# EAGLE schematic Nusbio Test GPIOS Extension (EAGLE 9.6.2)
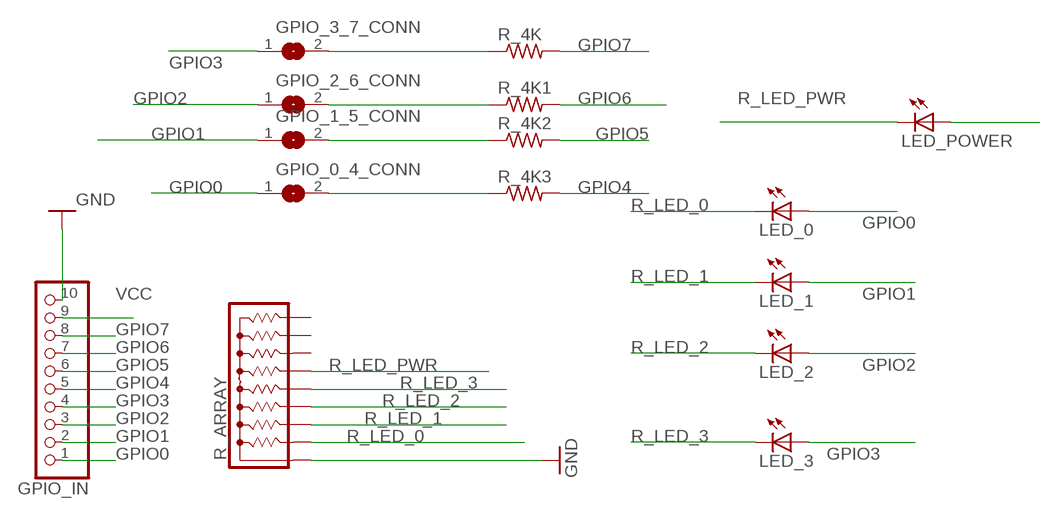
[diagram p0: schematic, sheet 1]

## Parts
GPIO_0_4_CONN  SOLDERJUMPERREFLOW  [SOLDERJUMPER_REFLOW]
GPIO_1_5_CONN  SOLDERJUMPERREFLOW  [SOLDERJUMPER_REFLOW]
GPIO_2_6_CONN  SOLDERJUMPERREFLOW  [SOLDERJUMPER_REFLOW]
GPIO_3_7_CONN  SOLDERJUMPERREFLOW  [SOLDERJUMPER_REFLOW]
GPIO_IN  PINHD-1X10  [1X10-BIG]
LED_0  LEDSMT1206  [1206]
LED_1  LEDSMT1206  [1206]
LED_2  LEDSMT1206  [1206]
LED_3  LEDSMT1206  [1206]
LED_POWER  LEDSMT1206  [1206]
R_4K  R-US_R1206  [R1206]
R_4K1  R-US_R1206  [R1206]
R_4K2  R-US_R1206  [R1206]
R_4K3  R-US_R1206  [R1206]
R_ARRAY  4609X  [SIP9]

## Nets
GND: GPIO_IN.10 R_ARRAY.1
GPIO0: GPIO_0_4_CONN.1 GPIO_IN.1 LED_0.A
GPIO1: GPIO_1_5_CONN.1 GPIO_IN.2 LED_1.A
GPIO2: GPIO_2_6_CONN.1 GPIO_IN.3 LED_2.A
GPIO3: GPIO_3_7_CONN.1 GPIO_IN.4 LED_3.A
GPIO4: GPIO_IN.5 R_4K3.2
GPIO5: GPIO_IN.6 R_4K2.2
GPIO6: GPIO_IN.7 R_4K1.2
GPIO7: GPIO_IN.8 R_4K.2
N$1: GPIO_3_7_CONN.2 R_4K.1
N$2: GPIO_2_6_CONN.2 R_4K1.1
N$3: GPIO_1_5_CONN.2 R_4K2.1
N$4: GPIO_0_4_CONN.2 R_4K3.1
R_LED_0: LED_0.C R_ARRAY.2
R_LED_1: LED_1.C R_ARRAY.3
R_LED_2: LED_2.C R_ARRAY.4
R_LED_3: LED_3.C R_ARRAY.5
R_LED_PWR: LED_POWER.C R_ARRAY.6
VCC: GPIO_IN.9 LED_POWER.A
Unconnected: R_ARRAY.7 R_ARRAY.8 R_ARRAY.9

## Library data of the parts
GPIO_0_4_CONN GPIO_1_5_CONN GPIO_2_6_CONN GPIO_3_7_CONN = microbuilder:SOLDERJUMPER: SMD Solder JUMPER Solder the two pads together to create a connection, or remove the solder to break it. REFLOW - Use this footprint for solder paste and reflow ovens. WAVE - Use this footprint for hand-soldering (larger pads). CLOSED - Has a trace between the two pads to ensure it is closed by default. The trace needs to be cut to disable the jumper, and can be closed again by creating a solder bridge between the two pads.
GPIO_IN = adafruit:PINHD-1X10: Pin header 1x10 0.1" spacing With round pins
LED_0 LED_1-LED_3 LED_POWER = adafruit:LED: LED OSRAM: - CHIPLED LG R971, LG N971, LY N971, LG Q971, LY Q971, LO R971, LY R971 LH N974, LH R974 LS Q976, LO Q976, LY Q976 LO Q996 - Hyper CHIPLED LW Q18S LB Q993, LB Q99A, LB R99A - SideLED LS A670, LO A670, LY A670, LG A670, LP A670 LB A673, LV A673, LT A673, LW A673 LH A674 LY A675 LS A676, LA A676, LO A676, LY A676, LW A676 LS A679, LY A679, LG A679 - Hyper Micro SIDELED® LS Y876, LA Y876, LO Y876, LY Y876 LT Y87S - SmartLED LW L88C, LW L88S LB L89C, LB L89S, LG L890 LS L89K, LO L89K, LY L89K LS L896, LA L896, LO L896, LY L896 - TOPLED LS T670, LO T670, LY T670, LG T670, LP T670 LSG T670, LSP T670, LSY T670, LOP T670, LYG T670 LG T671, LOG T671, LSG T671 LB T673, LV T673, LT T673, LW T673 LH T674 LS T676, LA T676, LO T676, LY T676, LB T676, LH T676, LSB T676, LW T676 LB T67C, LV T67C, LT T67C, LS T67K, LO T67K, LY T67K, LW E67C LS E67B, LA E67B, LO E67B, LY E67B, LB E67C, LV E67C, LT E67C LW T67C LS T679, LY T679, LG T679 LS T770, LO T770, LY T770, LG T770, LP T770 LB T773, LV T773, LT T773, LW T773 LH T774 LS E675, LA E675, LY E675, LS T675 LS T776, LA T776, LO T776, LY T776, LB T776 LHGB T686 LT T68C, LB T68C - Hyper Mini TOPLED® LB M676 - Mini TOPLED Santana® LG M470 LS M47K, LO M47K, LY M47K Source: http://www.osram.convergy.de/
R_4K R_4K1-R_4K3 = adafruit:R-US_: RESISTOR, American symbol
R_ARRAY = resistor-sip:4609X: Bourns 4600X Series - Thick Film Conformal SIPs 4609X-101 Resistor Network Configuration: 101 (Bussed Resistors) Resistance range: 10 ohms to 10 Megaohms Maximum Operating Voltage: 100V Source: http://www.bourns.com/ProductLine.aspx?name=standard_thick_film_networks PDF: http://www.bourns.com/data/global/pdfs/4600X.pdf